# EAGLE design motor_board (EAGLE 8.3.1)
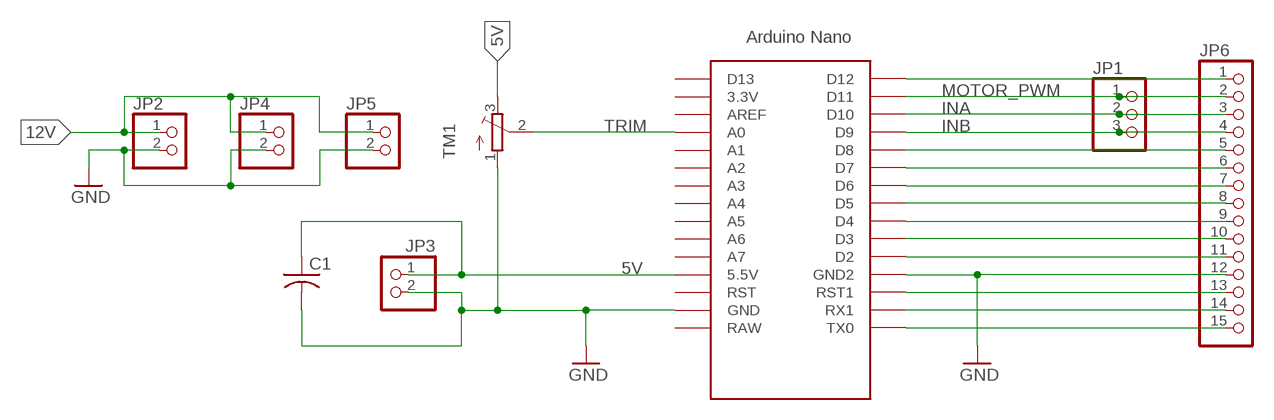
[diagram p0: schematic, sheet 1]

## Parts
C1  C-US025-060X050  [C025-060X050]
JP1  PINHD-1X3  [1X03]
JP2  PINHD-1X2  [1X02]
JP3  PINHD-1X2  [1X02]
JP4  PINHD-1X2  [1X02]
JP5  PINHD-1X2  [1X02]
JP6  PINHD-1X15  [1X15]
TM1  TRIMPOT3386  [TRIM-3386]
U$2  NANO  [NANO]

## Nets
5V: C1.1 JP3.1 TM1.3(E) U$2.5V(5.5V)
12V: JP2.1 JP4.1 JP5.1
GND: C1.2 JP2.2 JP3.2 JP4.2 JP5.2 JP6.12 TM1.1(A) U$2.GND U$2.GND1(GND2)
INA: JP1.2 JP6.3 U$2.D10
INB: JP1.3 JP6.4 U$2.D9
MOTOR_PWM: JP1.1 JP6.2 U$2.D11
N$1: JP6.1 U$2.D12
N$2: JP6.5 U$2.D8
N$3: JP6.6 U$2.D7
N$4: JP6.7 U$2.D6
N$5: JP6.8 U$2.D5
N$6: JP6.9 U$2.D4
N$7: JP6.10 U$2.D3
N$8: JP6.11 U$2.D2
N$9: JP6.13 U$2.RST1
N$10: JP6.14 U$2.RX1
N$11: JP6.15 U$2.TX0
TRIM: TM1.2(S) U$2.A0
Unconnected: U$2.3.3V U$2.A1 U$2.A2 U$2.A3 U$2.A4 U$2.A5 U$2.A6 U$2.A7 U$2.AREF U$2.D13 U$2.ICSP1 U$2.ICSP2 U$2.ICSP3 U$2.ICSP4 U$2.ICSP5 U$2.ICSP6 U$2.RAW U$2.RST

## Library data of the parts
C1 = adafruit:C-US: CAPACITOR, American symbol
JP1 = pinhead:PINHD-1X3: PIN HEADER
JP2-JP5 = pinhead:PINHD-1X2: PIN HEADER
JP6 = pinhead:PINHD-1X15: PIN HEADER
TM1 = adafruit:TRIMPOT: SMT trimmer potentiometer part number TC33X http://www.ladyada.net/library/eagle
U$2 = Arduino-clone:NANO: Arduino Nano

## Board
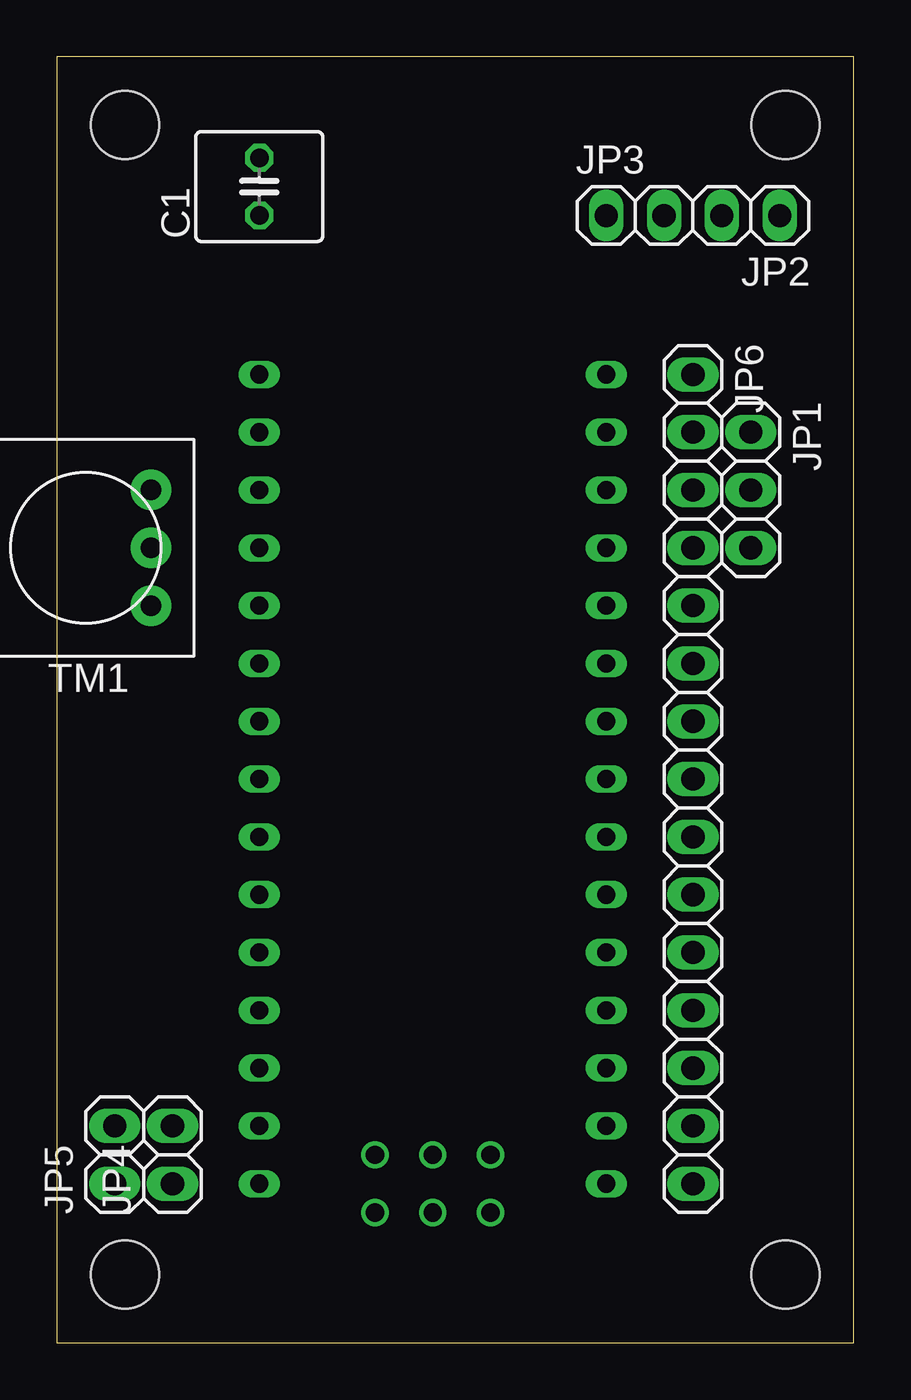
[diagram p1: board, top side]
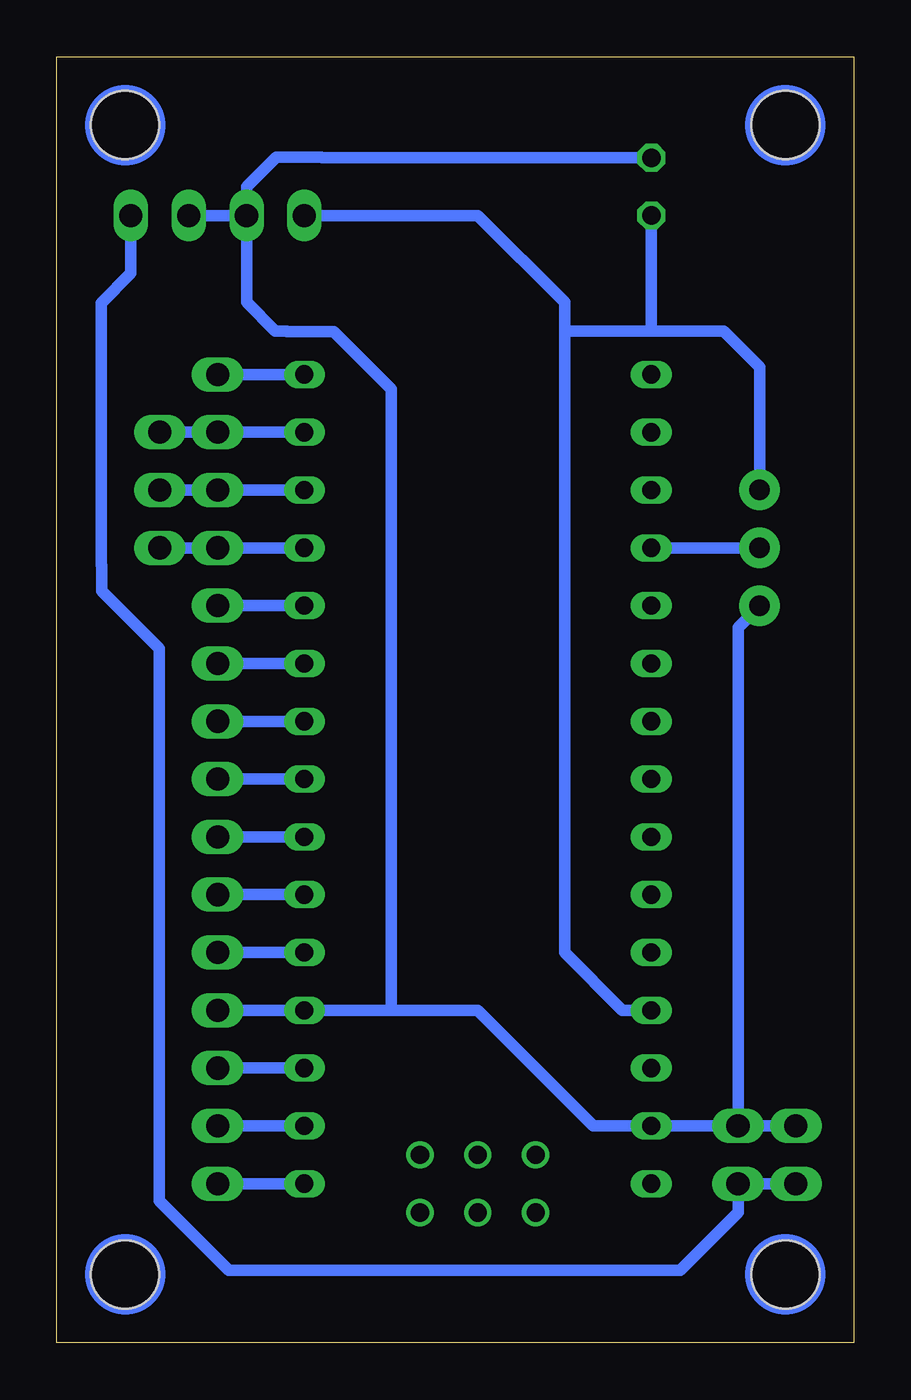
[diagram p2: board, bottom side, seen from below]

Size 35 x 56.5 mm. Coordinates in mm from the lower left corner, seen from the top.
Outline: 0,0 35,0 35,56.5 0,56.5 0,0
Copper layers (1*16): Top 0.035mm / dielectric 1.5mm / Bottom 0.035mm
Design rules "OthermillDRC_1_64_v2": minimum track width 16mil, minimum drill 31mil, track to track 0.39878125mm, track to pad 0.39878125mm, pad to pad 0.39878125mm, via to via 0.39878125mm, smd to smd 0mil, copper to edge 0mil, drill to drill 1mil, minimum pad ring 0mil, minimum via ring 15mil, stop-mask expansion 1mil, vias tented up to drill 30mil, thermal gap 10mil
Holes 3 mm at 3,3 32,3 32,53.5 3,53.5

### Footprints (pad centres in the part's own frame; a part is rotated, then mirrored left to right if it is on the bottom)
C025-060X050 = drill 0.813 octagon: 1 -1.27,0; 2 1.27,0
1X03 = drill 1.016 long: 1 -2.54,0; 2 0,0; 3 2.54,0
1X02 = drill 1.016 long: 1 -1.27,0; 2 1.27,0
1X15 = drill 1.016 long: 1 -17.78,0; 2 -15.24,0; 3 -12.7,0; 4 -10.16,0; 5 -7.62,0; 6 -5.08,0; 7 -2.54,0; 8 0,0; 9 2.54,0; 10 5.08,0; 11 7.62,0; 12 10.16,0; 13 12.7,0; 14 15.24,0; 15 17.78,0
TRIM-3386 = drill 0.9 pad 1.778: 1 -2.54,-2.857; 2 0,-2.857; 3 2.54,-2.857
NANO = drill 0.8 long: 3.3V -10.16,24.13; 5V -10.16,-1.27; A0 -10.16,19.05; A1 -10.16,16.51; A2 -10.16,13.97; A3 -10.16,11.43; A4 -10.16,8.89; A5 -10.16,6.35; A6 -10.16,3.81; A7 -10.16,1.27; AREF -10.16,21.59; D2 5.08,1.27; D3 5.08,3.81; D4 5.08,6.35; D5 5.08,8.89; D6 5.08,11.43; D7 5.08,13.97; D8 5.08,16.51; D9 5.08,19.05; D10 5.08,21.59; D11 5.08,24.13; D12 5.08,26.67; D13 -10.16,26.67; GND -10.16,-6.35; GND1 5.08,-1.27; RAW -10.16,-8.89; RST -10.16,-3.81; RST1 5.08,-3.81; RX1 5.08,-6.35; TX0 5.08,-8.89 | drill 0.8: ICSP1 -5.08,-10.16; ICSP2 -5.08,-7.62; ICSP3 -2.54,-10.16; ICSP4 -2.54,-7.62; ICSP5 0,-10.16; ICSP6 0,-7.62

### Placement (x,y rotation side)
C1  8.89,50.8 90 top
JP1  30.48,37.47 270 top
JP2  30.48,49.53 180 top
JP3  25.4,49.53 0 top
JP4  5.08,8.26 90 top
JP5  2.54,8.26 90 top
JP6  27.94,24.77 270 top
TM1  1.27,34.92 90 top
U$2  19.05,15.88 0 top

### Tracks (layer width: path | path; a pad name or v marks a point on that pad's centre or on a via)
5V
  Bottom 0.508: TM1.3 4.13,42.86 5.71,44.45 8.87,44.45 | U$2.5V 10.16,14.61 12.7,17.14 12.7,44.43 12.68,44.45 12.67,44.45 | 8.87,44.45 12.67,44.45 | JP3.1 16.51,49.53 12.7,45.72 12.7,44.48 12.67,44.45 | C1.1 8.89,44.47 8.87,44.45
12V
  Bottom 0.508: JP5.1 JP4.1 5.08,5.71 7.62,3.17 27.45,3.17 30.51,6.24 30.51,30.51 33.02,33.02 33.02,34.14 33.05,34.17 33.05,45.69 31.75,46.99 JP2.1
GND
  Bottom 0.508: JP4.2 U$2.GND 11.43,9.53 16.51,14.61 20.47,14.61 | JP4.2 5.08,31.43 TM1.1 | 20.47,14.61 U$2.GND1 JP6.12 | 20.47,14.61 20.32,14.76 20.32,41.91 22.83,44.42 24.88,44.42 24.91,44.45 25.4,44.45 26.67,45.72 JP3.2 26.81,49.53 | C1.2 23.35,52.07 23.38,52.1 25.37,52.1 26.67,50.8 26.67,49.67 26.81,49.53 | JP2.2 26.81,49.53 | JP4.2 JP5.2
INA
  Bottom 0.508: U$2.D10 JP6.3 JP1.2
INB
  Bottom 0.508: U$2.D9 JP6.4 JP1.3
MOTOR_PWM
  Bottom 0.508: U$2.D11 JP6.2 JP1.1
N$1
  Bottom 0.508: U$2.D12 JP6.1
N$2
  Bottom 0.508: U$2.D8 JP6.5
N$3
  Bottom 0.508: U$2.D7 JP6.6
N$4
  Bottom 0.508: U$2.D6 JP6.7
N$5
  Bottom 0.508: U$2.D5 JP6.8
N$6
  Bottom 0.508: U$2.D4 JP6.9
N$7
  Bottom 0.508: U$2.D3 JP6.10
N$8
  Bottom 0.508: U$2.D2 JP6.11
N$9
  Bottom 0.508: U$2.RST1 JP6.13
N$10
  Bottom 0.508: U$2.RX1 JP6.14
N$11
  Bottom 0.508: U$2.TX0 JP6.15
TRIM
  Bottom 0.508: U$2.A0 TM1.2
(copper drawn outside any net)
  shapes: Bottom circle x4